# Altium schematic sheet FPGA_Burch_Spartan2E_B5-X300_Board.SchDoc: Example for Burch B5-X300 Board
size B; Organization: Altium Limited; Address1: L3, 12a Rodborough Rd; Address2: Frenchs Forest; Address3: NSW; Address4: Australia 2086; DocumentNumber: 1; SheetNumber: 1; SheetTotal: 1
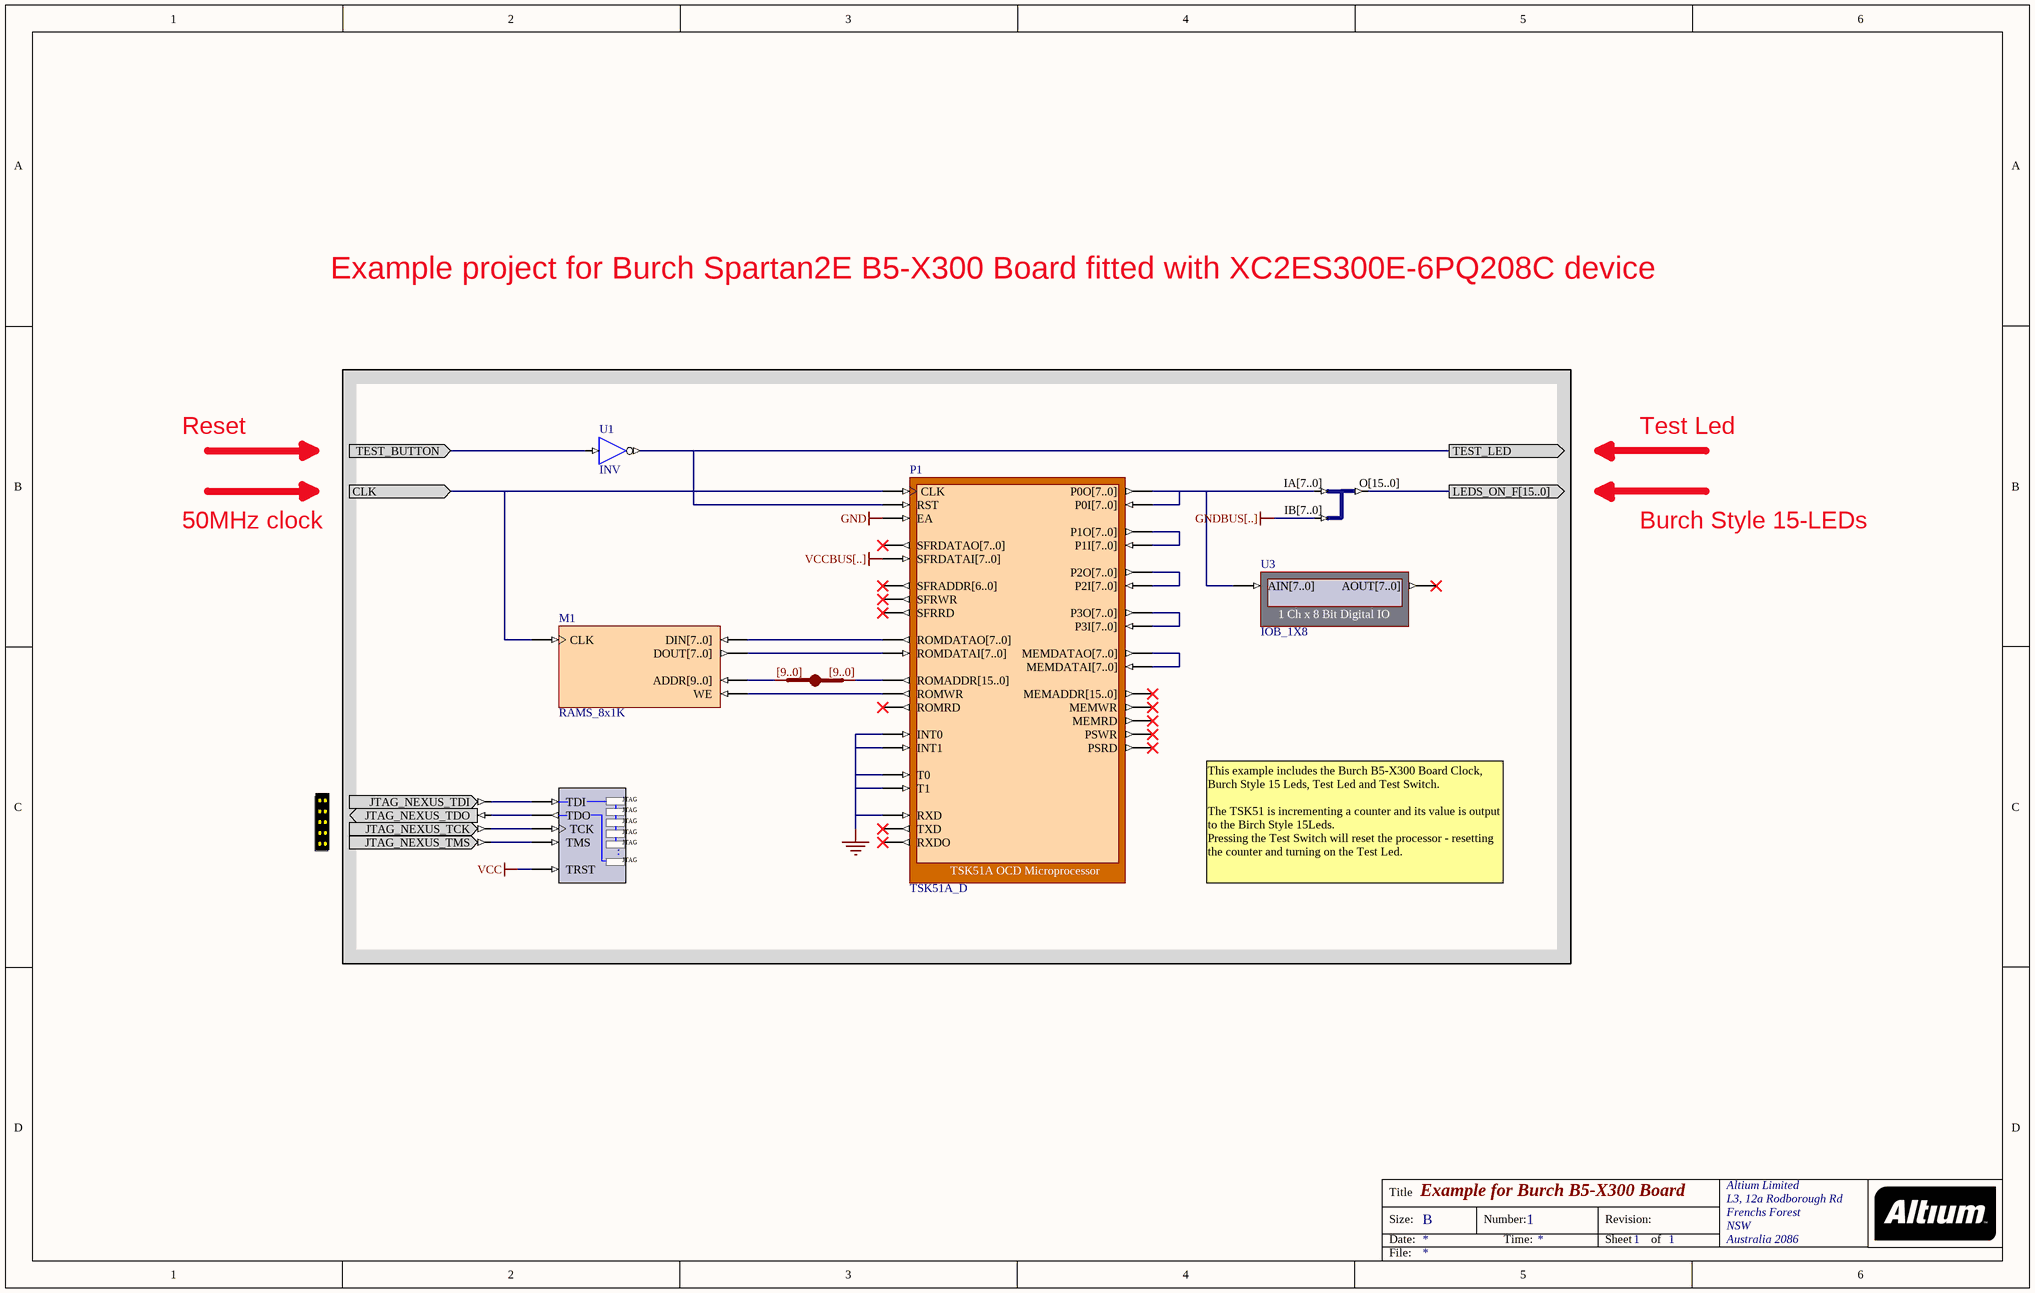
[diagram p0: FPGA_Burch_Spartan2E_B5-X300_Board.SchDoc]

## Parts
?  NEXUS_JTAG_CONNECTOR  (value not drawn)
JB_S1  IndexA: [9..0]  (hidden comment: JB)
M1  RAMS_8x1K
NEXUS_JTAG_PORT  NEXUS_JTAG_PORT  (value not drawn)
P1  TSK51A_D
U1  INV
U2  J8B2_16B  (value not drawn)
U3  IOB_1X8

## Ports
CLK (in), LEDS_ON_F[15..0] (out), TEST_BUTTON (in), TEST_LED (out)

## Nets
GND: P1.EA P1.INT0 P1.INT1 P1.RXD P1.T0 P1.T1
GNDBUS[..]: U2.IB[7..0]
VCC: NEXUS_JTAG_PORT.TRST
VCCBUS[..]: P1.SFRDATAI[7..0]
CLK: M1.CLK P1.CLK ; port CLK
LEDS_ON_F[15..0]: U2.O[15..0] ; port LEDS_ON_F[15..0]
TEST_BUTTON: U1.I ; port TEST_BUTTON
TEST_LED: P1.RST U1.O ; port TEST_LED
Net?_JTAG_NEXUS_TCK: ?.JTAG_NEXUS_TCK NEXUS_JTAG_PORT.TCK
Net?_JTAG_NEXUS_TDI: ?.JTAG_NEXUS_TDI NEXUS_JTAG_PORT.TDI
Net?_JTAG_NEXUS_TDO: ?.JTAG_NEXUS_TDO NEXUS_JTAG_PORT.TDO
Net?_JTAG_NEXUS_TMS: ?.JTAG_NEXUS_TMS NEXUS_JTAG_PORT.TMS
NetJB_S1_A[0..0]: JB_S1.A[0..0] M1.ADDR[9..0]
NetJB_S1_B[0..0]: JB_S1.B[0..0] P1.ROMADDR[15..0]
NetM1_DIN[7..0]: M1.DIN[7..0] P1.ROMDATAO[7..0]
NetM1_DOUT[7..0]: M1.DOUT[7..0] P1.ROMDATAI[7..0]
NetM1_WE: M1.WE P1.ROMWR
NetP1_MEMDATAI[7..0]: P1.MEMDATAI[7..0] P1.MEMDATAO[7..0]
NetP1_P0I[7..0]: P1.P0I[7..0] P1.P0O[7..0] U2.IA[7..0] U3.AIN[7..0]
NetP1_P1I[7..0]: P1.P1I[7..0] P1.P1O[7..0]
NetP1_P2I[7..0]: P1.P2I[7..0] P1.P2O[7..0]
NetP1_P3I[7..0]: P1.P3I[7..0] P1.P3O[7..0]

Not connected (* = marked no-connect by the designer): P1 MEMADDR[15..0]* MEMRD* MEMWR* PSRD* PSWR* ROMRD* RXDO* SFRADDR[6..0]* SFRDATAO[7..0]* SFRRD* SFRWR* TXD*; U3 AOUT[7..0]*

## Notes on the sheet
- Example project for Burch Spartan2E B5-X300 Board fitted with XC2ES300E-6PQ208C device
- Reset
- 50MHz clock
- Test Led
- Burch Style 15-LEDs
- This example includes the Burch B5-X300 Board Clock, Burch Style 15 Leds, Test Led and Test Switch.
  The TSK51 is incrementing a counter and its value is output to the Birch Style 15Leds.
  Pressing the Test Switch will reset the processor - resetting the counter and turning on the Test Led.
- Title
- Size:
- Date:
- B
- Number:
- Time:
- Revision:
- Sheet
- of
- File:
- (in symbol NEXUS_JTAG_PORT) JTAG; .

## Library data of the parts
? = NEXUS_JTAG_CONNECTOR: JTAG Port; PortComponent: True; Published: 19-Nov-2003; Publisher: Altium Limited
JB_S1 = JB: System BUS Joiner; Published: 29-Jan-2004; Publisher: Altium Limited; LastRevisionNo: 1.00.00; HelpURL: CR0118 FPGA Generic Library Guide.pdf#page=296; FunctionalClass: Bus Joiner; IndexB: [9..0]
M1 = RAMS_8x1K: Single Port RAM; Memory_Depth: 1024; Memory_Type: RAM_SinglePortBlock; Memory_Width: 8; Memory_ClockEdge: Rising; Nexus_Core: Memory_Program; Memory_EnablePin: False; Published: 11/10/2004; Publisher: Altium Hobart Technology Center; Memory_ByteWrites: False
NEXUS_JTAG_PORT = NEXUS_JTAG_PORT: Nexus Processor JTAG Chain Connector; NEXUS_JTAG_CONNECTOR: True; Published: 18-Nov-2003; Publisher: Altium Limited
P1 = TSK51A_D: TSK51A OCD Microprocessor; NEXUS_CORE: Processor_OCDS; NEXUS_JTAG_DEVICE: True; NEXUS_JTAG_ORDER: 0; ChildModel1: RAM256x8_TSK51D; ChildCore1: M1; Published: 18/12/2003; Publisher: Altium Hobart Technology Centre; Core Revision: 1.00.00
U1 = INV: Inverter; FunctionalClass: Logic Primitive; ArchiveName: GENERIC; VHDLIB_SIM: GENERIC_LIB; Published: 29-Jan-2004; Publisher: Altium Limited; XilinxEquivalent: INV; LastRevisionNo: 1.00.00; HelpURL: CR0118 FPGA Generic Library Guide.pdf#page=290; SubClass: INV
U2 = J8B2_16B: 2 x 8-Bit input bus to 1 x 16-bit output bus; FunctionalClass: Bus Joiner; PortSize: 8; ArchiveName: GENERIC; VHDLIB_SIM: GENERIC_LIB; Published: 29-Jan-2004; Publisher: Altium Limited; LastRevisionNo: 1.00.00; HelpURL: CR0118 FPGA Generic Library Guide.pdf#page=301
U3 = IOB_1X8: 1 Ch x 8 Bit Digital IO; NEXUS_CORE: Instrument; NEXUS_JTAG_DEVICE: True; NEXUS_JTAG_ORDER: 0; Published: 30/09/2003; Publisher: Altium Hobart Technology Centre; Core Revision: 1.00.00